# Altium project esp32_radar.PrjPcb
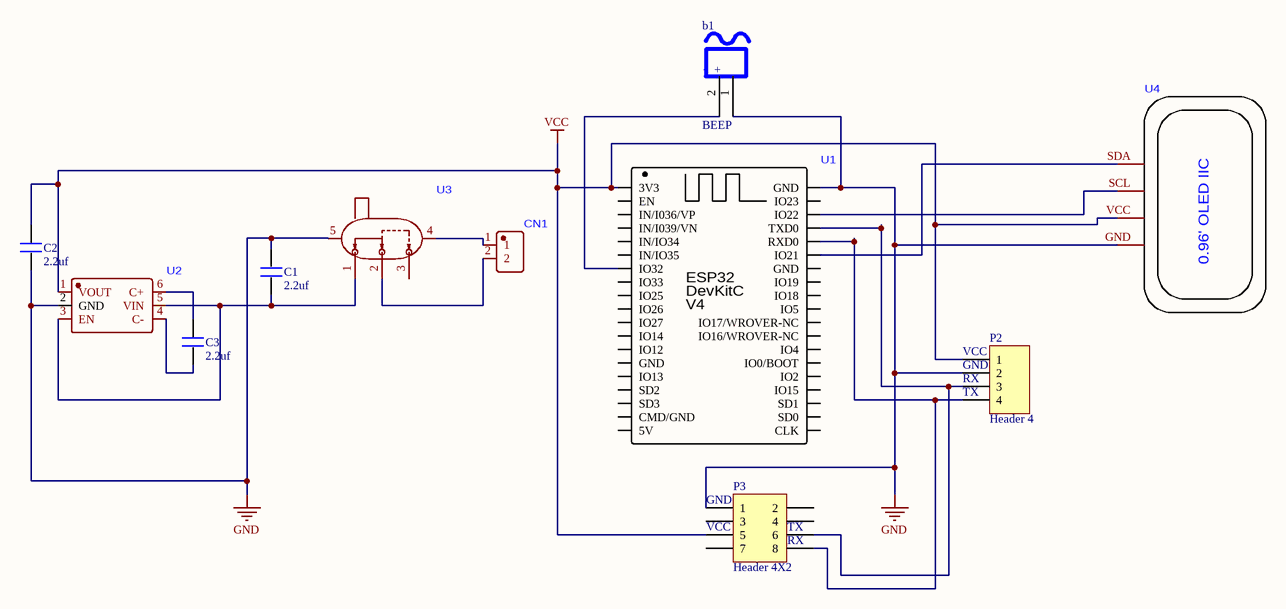
[diagram p0: Sheet2.SchDoc]
6 sheets, 16 parts. Net scope: global (net labels, ports and power ports of the same name join across sheets).
Board files: PCBv_1.PcbDoc, switch-SS12D11-G5_2024-05-03.pcbdoc, 0.96OLEDIIC_2024-05-03.pcbdoc, SOT-23-6_L2.9-W1.6-P0.95-LS2.8-BL-1_2024-04-30.pcbdoc, XH2.54-2P_2024-04-30.pcbdoc, ESP32DEVKITC_2024-03-25.pcbdoc
Sheets:
  Sheet2.SchDoc
  XH2.54-2P_直插_2024-04-30.schdoc
  switch-SS12D11-G5_2024-05-03.schdoc
  0.96OLED_4P_2024-05-03.schdoc
  PW5410B_2024-04-30.schdoc
  ESP32DevKitC_2024-03-25.schdoc

## Sheet Sheet2.SchDoc
size A4

### Parts
b1  BEEP  [beep]
C1  2.2uf  [C_0603]
C2  2.2uf  [C_0603]
C3  2.2uf  [C_0603]
CN1  (no value)  [CONN-TH_2P-P2.50-XH2.54-2P]
P2  Header 4  [HDR1X4]
P3  Header 4X2  [HDR2X4]
U1  (no value)  [ESP32DEVKITC]
U2  (no value)  [SOT-23-6_L2.9-W1.6-P0.95-LS2.8-BL-1]
U3  (no value)  [SW-TH_KH-SS12D11-G5]
U4  (no value)  [0.96OLEDIIC]

### Nets
GND: b1.1 C1.2 C2.1 P2.2 P3.1 U1.38(GND) U2.2(GND) U3.5 U4.GND
VCC: C2.2 P2.1 P3.5 U1.1(3V3) U2.1(VOUT) U4.VCC
Netb1_2: b1.2 U1.7(IO32)
NetC1_1: C1.1 U2.3(EN) U2.5(VIN) U3.1
NetC3_1: C3.1 U2.4(C-)
NetC3_2: C3.2 U2.6(C+)
NetCN1_1: CN1.1 U3.4
NetCN1_2: CN1.2 U3.2
NetP2_3: P2.3 P3.6 U1.35(TXD0)
NetP2_4: P2.4 P3.8 U1.34(RXD0)
NetU1_33: U1.33(IO21) U4.SDA
NetU1_36: U1.36(IO22) U4.SCL

Not connected (* = marked no-connect by the designer): P3 2 3 4 7; U1 2(EN) 3(IN/I036/VP) 4(IN/I039/VN) 5(IN/IO34) 6(IN/IO35) 8(IO33) 9(IO25) 10(IO26) 11(IO27) 12(IO14) 13(IO12) 14(GND) 15(IO13) 16(SD2) 17(SD3) 18(CMD/GND) 19(5V) 20(CLK) 21(SD0) 22(SD1) 23(IO15) 24(IO2) 25(IO0/BOOT) 26(IO4) 27(IO16/WROVER-NC) 28(IO17/WROVER-NC) 29(IO5) 30(IO18) 31(IO19) 32(GND) 37(IO23); U3 3

### Notes on the sheet
- (near P2) VCC
- (near P2) GND
- (near P2) RX
- (near P2) TX
- (near P3) GND
- (near P3) VCC
- (near P3) RX
- (near P3) TX
- (in symbol 0.96OLED_4P) 0.96' OLED IIC
- (in symbol BEEP) +
- (in symbol ESP32DevKitC) ESP32; DevKitC; V4

### Library data of the parts
C1-C3 = C
CN1 = XH2.54*2P_直插
P2 = Header 4: Header, 4-Pin; LatestRevisionDate: 17-Jul-2002; LatestRevisionNote: Re-released for DXP Platform.; Publisher: Altium Limited
P3 = Header 4X2: Header, 4-Pin, Dual row; LatestRevisionDate: 17-Jul-2002; LatestRevisionNote: Re-released for DXP Platform.; Publisher: Altium Limited
U1 = ESP32DevKitC
U2 = PW5410B
U3 = KH-SS12D11-G5
U4 = 0.96OLED_4P

## Sheet XH2.54-2P_直插_2024-04-30.schdoc
size 39 x 30 mm
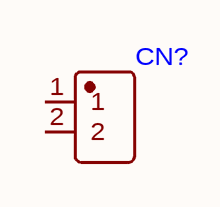
[diagram p1: XH2.54-2P_直插_2024-04-30.schdoc]

### Parts
CN?  (no value)  [CONN-TH_2P-P2.50-XH2.54-2P]

### Nets

Not connected (* = marked no-connect by the designer): CN? 1 2

### Library data of the parts
CN? = XH2.54*2P_直插

## Sheet switch-SS12D11-G5_2024-05-03.schdoc
size 52 x 37 mm
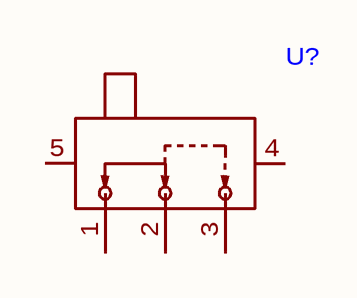
[diagram p2: switch-SS12D11-G5_2024-05-03.schdoc]

### Parts
(Parts that share a designator on the sheet are numbered #1, #2 ... from top to bottom, then left to right.)
U?#1  (no value)  [SW-TH_KH-SS12D11-G5]

### Nets

Not connected (* = marked no-connect by the designer): U?#1 1 2 3 4 5

### Library data of the parts
U?#1 = KH-SS12D11-G5

## Sheet 0.96OLED_4P_2024-05-03.schdoc
size 72 x 50 mm
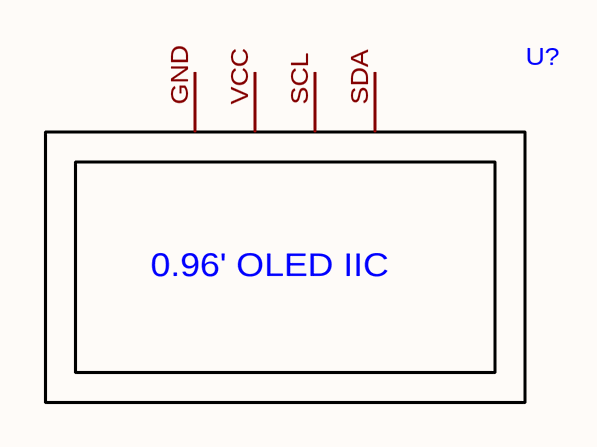
[diagram p3: 0.96OLED_4P_2024-05-03.schdoc]

### Parts
(Parts that share a designator on the sheet are numbered #1, #2 ... from top to bottom, then left to right.)
U?#2  (no value)  [0.96OLEDIIC]

### Nets

Not connected (* = marked no-connect by the designer): U?#2 GND SCL SDA VCC

### Notes on the sheet
- (in symbol 0.96OLED_4P) 0.96' OLED IIC

### Library data of the parts
U?#2 = 0.96OLED_4P

## Sheet PW5410B_2024-04-30.schdoc
size 52 x 32 mm
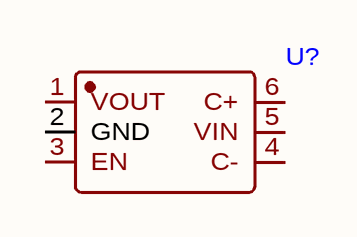
[diagram p4: PW5410B_2024-04-30.schdoc]

### Parts
(Parts that share a designator on the sheet are numbered #1, #2 ... from top to bottom, then left to right.)
U?#3  (no value)  [SOT-23-6_L2.9-W1.6-P0.95-LS2.8-BL-1]

### Nets

Not connected (* = marked no-connect by the designer): U?#3 1(VOUT) 2(GND) 3(EN) 4(C-) 5(VIN) 6(C+)

### Library data of the parts
U?#3 = PW5410B

## Sheet ESP32DevKitC_2024-03-25.schdoc
size 69 x 74 mm
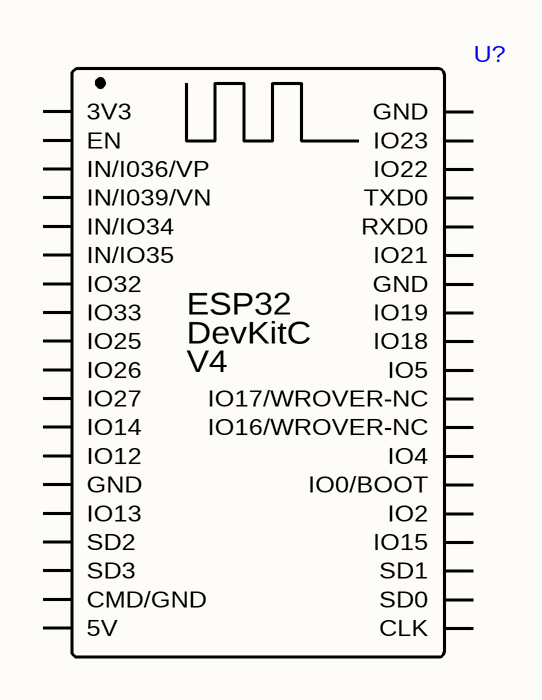
[diagram p5: ESP32DevKitC_2024-03-25.schdoc]

### Parts
(Parts that share a designator on the sheet are numbered #1, #2 ... from top to bottom, then left to right.)
U?#4  (no value)  [ESP32DEVKITC]

### Nets

Not connected (* = marked no-connect by the designer): U?#4 1(3V3) 2(EN) 3(IN/I036/VP) 4(IN/I039/VN) 5(IN/IO34) 6(IN/IO35) 7(IO32) 8(IO33) 9(IO25) 10(IO26) 11(IO27) 12(IO14) 13(IO12) 14(GND) 15(IO13) 16(SD2) 17(SD3) 18(CMD/GND) 19(5V) 20(CLK) 21(SD0) 22(SD1) 23(IO15) 24(IO2) 25(IO0/BOOT) 26(IO4) 27(IO16/WROVER-NC) 28(IO17/WROVER-NC) 29(IO5) 30(IO18) 31(IO19) 32(GND) 33(IO21) 34(RXD0) 35(TXD0) 36(IO22) 37(IO23) 38(GND)

### Notes on the sheet
- (in symbol ESP32DevKitC) ESP32; DevKitC; V4

### Library data of the parts
U?#4 = ESP32DevKitC